# EasyEDA schematic Sensor.json
TITLE: Sensors for RasPi; REV: 1.0; Date: 2024-08-23; Sheet: 1/1; Company: Your Company
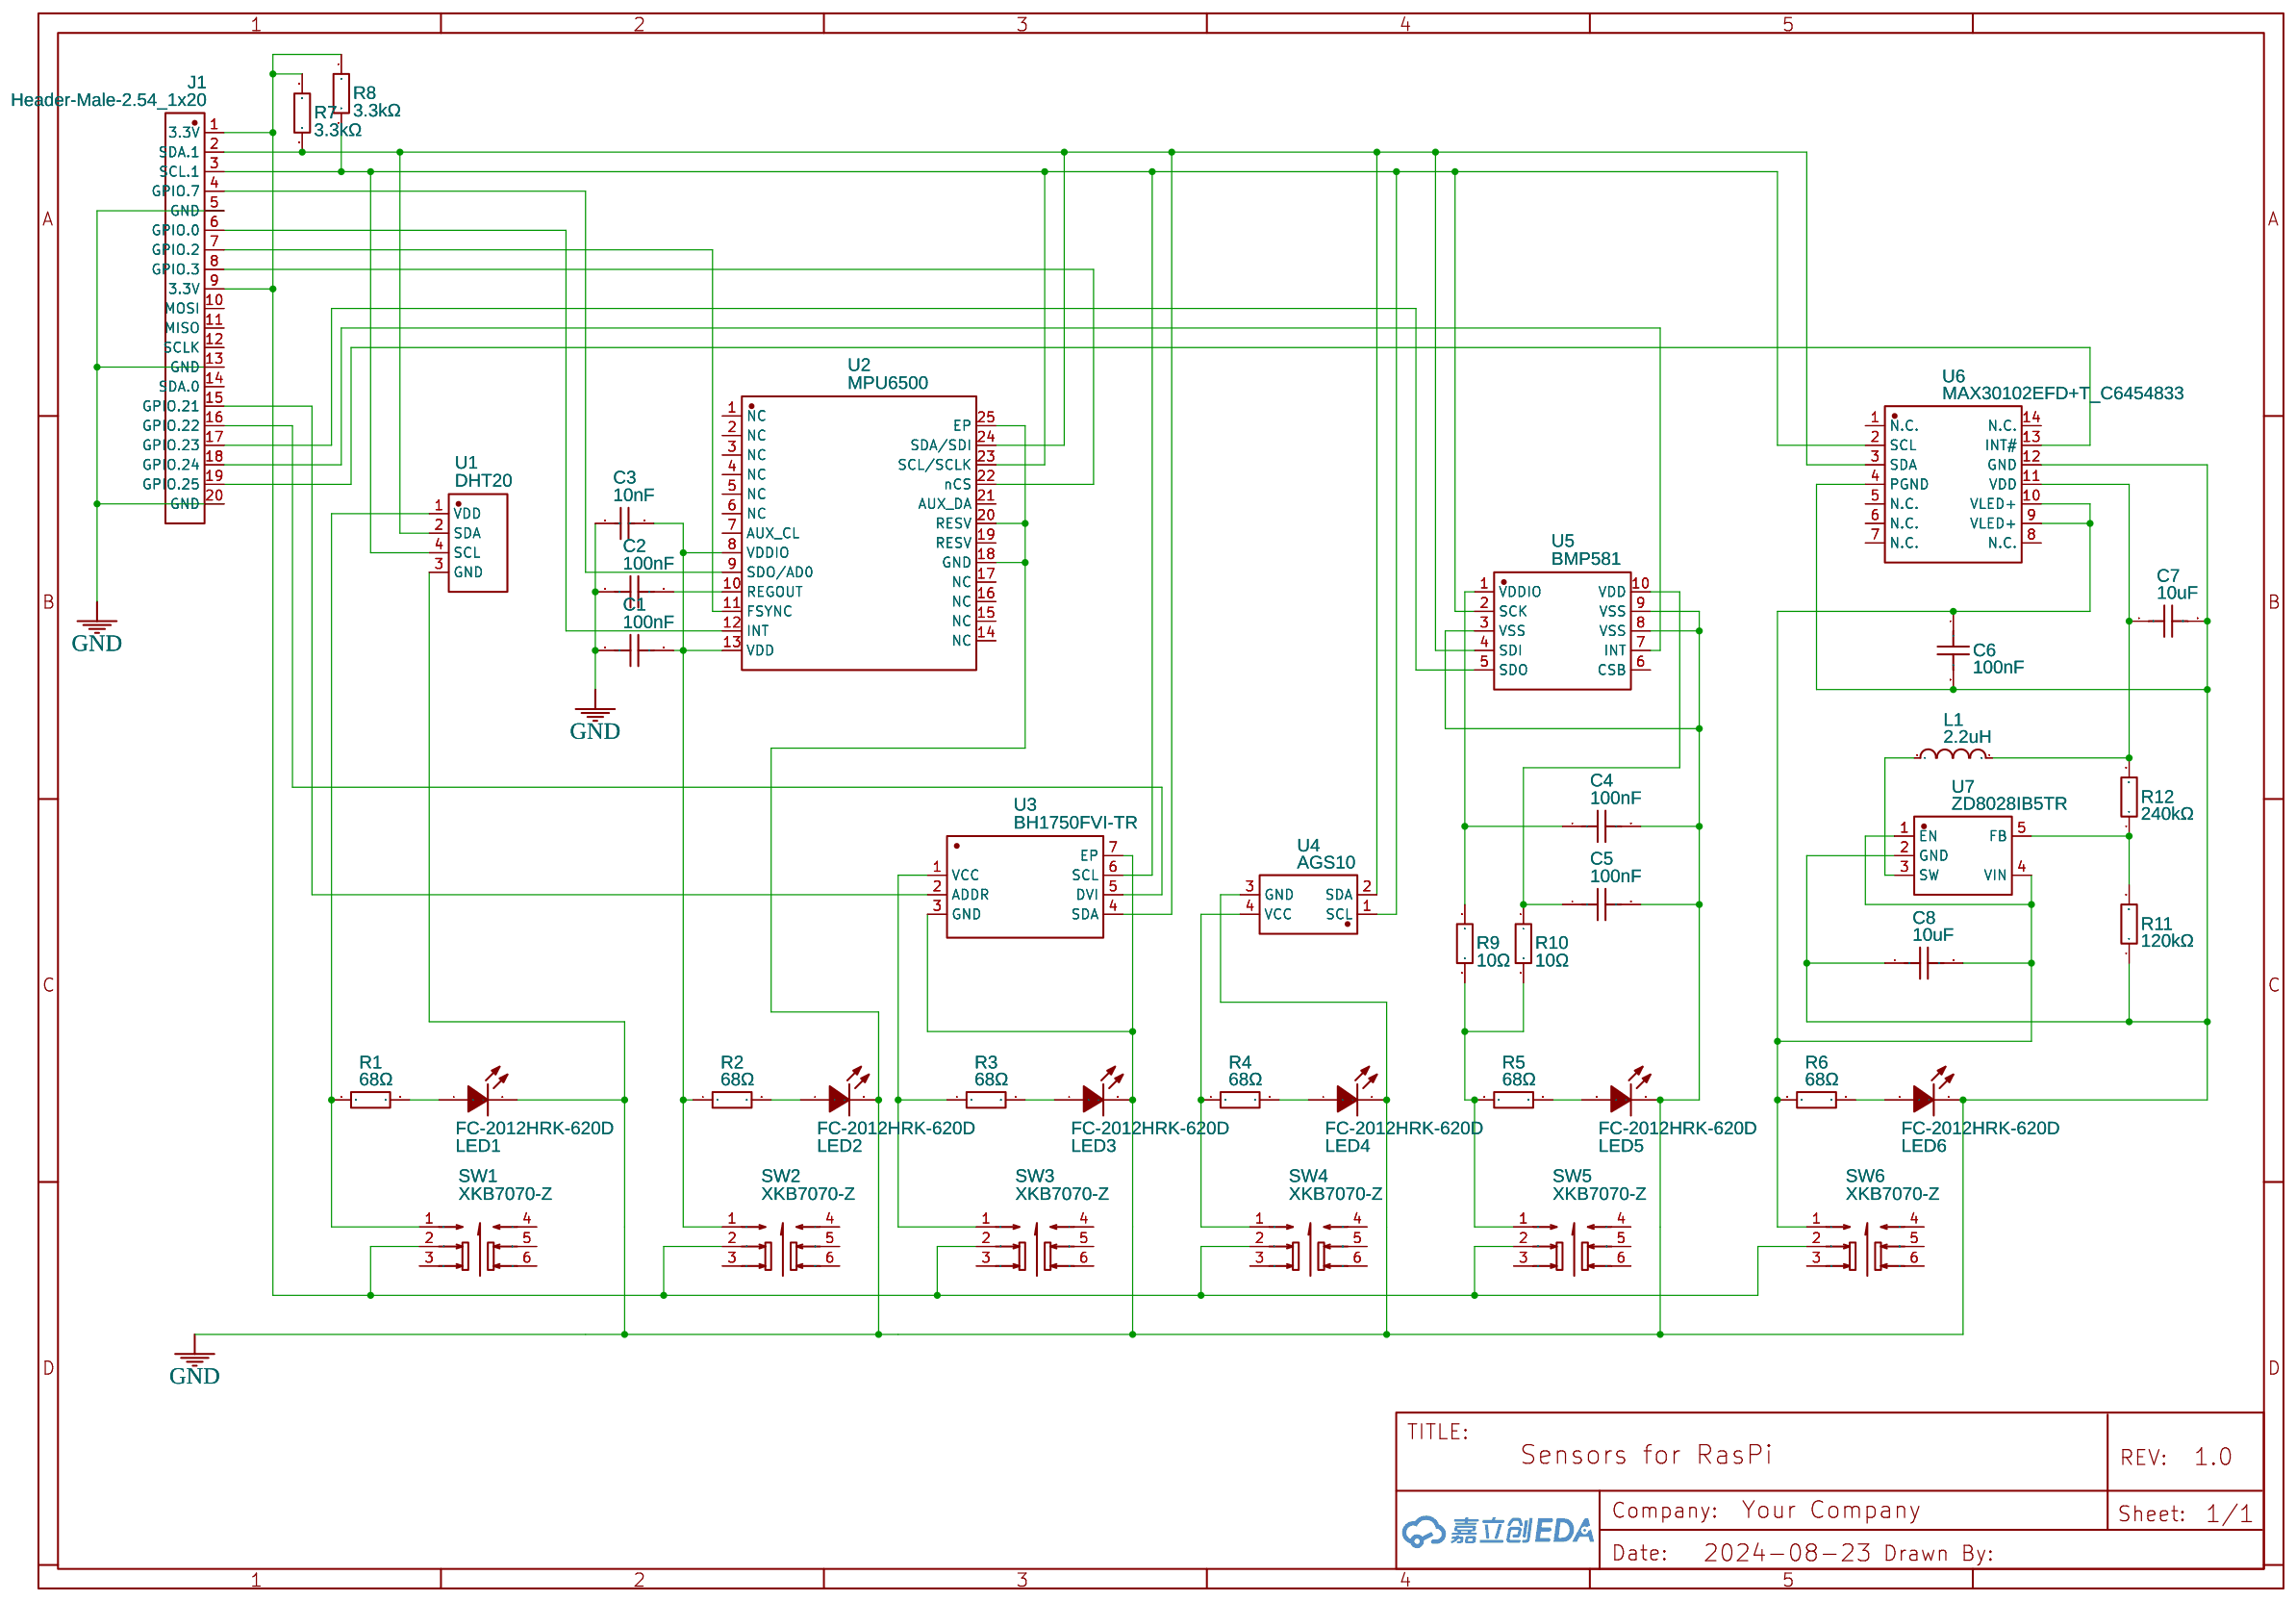
[diagram p0: schematic sheet]

## Parts
C1  100nF  [C0603]
C2  100nF  [C0603]
C3  10nF  [C0603]
C4  100nF  [C0603]
C5  100nF  [C0603]
C6  100nF  [C0603]
C7  10uF  [C0805]
C8  10uF  [C0805]
J1  Header-Male-2.54_1x20  [HDR-TH_20P-P2.54-V-M-1]
L1  2.2uH  [L0805]
LED1  FC-2012HRK-620D  [LED0805-R-RD]
LED2  FC-2012HRK-620D  [LED0805-R-RD]
LED3  FC-2012HRK-620D  [LED0805-R-RD]
LED4  FC-2012HRK-620D  [LED0805-R-RD]
LED5  FC-2012HRK-620D  [LED0805-R-RD]
LED6  FC-2012HRK-620D  [LED0805-R-RD]
R1  68Ω  [R0805]
R2  68Ω  [R0805]
R3  68Ω  [R0805]
R4  68Ω  [R0805]
R5  68Ω  [R0805]
R6  68Ω  [R0805]
R7  3.3kΩ  [R0603]
R8  3.3kΩ  [R0603]
R9  10Ω  [R0603]
R10  10Ω  [R0603]
R11  120kΩ  [R0603]
R12  240kΩ  [R0603]
SW1  XKB7070-Z  [SW-TH_6P-L7.0-W7.0-P2.00]
SW2  XKB7070-Z  [SW-TH_6P-L7.0-W7.0-P2.00]
SW3  XKB7070-Z  [SW-TH_6P-L7.0-W7.0-P2.00]
SW4  XKB7070-Z  [SW-TH_6P-L7.0-W7.0-P2.00]
SW5  XKB7070-Z  [SW-TH_6P-L7.0-W7.0-P2.00]
SW6  XKB7070-Z  [SW-TH_6P-L7.0-W7.0-P2.00]
U1  DHT20  [SENSOR-TH_DHT20]
U2  MPU6500  [QFN-24_L3.0-W3.0-P0.40-BL-EP]
U3  BH1750FVI-TR  [WSOF-6_L2.6-W1.6-P0.50-TL-EP]
U4  AGS10  [SENSOR-SMD_AGS10]
U5  BMP581  [LGA-10_L2.0-W2.0-P0.50-TL_BMP581]
U6  MAX30102EFD+T_C6454833  [OESIP-14_L5.6-W3.3-P0.80-TL]
U7  ZD8028IB5TR  [SOT-23-5_L2.9-W1.6-P0.95-LS2.9-BL]

## Library data of the parts
C1 C2 C4-C6 = CC0603KRX7R9BB104: Supplier: LCSC; Manufacturer: YAGEO(国巨); Supplier Part: C14663; JLCPCB Part Class: Basic Part
C3 = CC0603KRX7R9BB103: Supplier: LCSC; Manufacturer: YAGEO(国巨); Supplier Part: C100042; JLCPCB Part Class: Extended Part
C7 C8 = CL21A106KAYNNNE: Supplier: LCSC; Manufacturer: SAMSUNG(三星); Supplier Part: C15850; JLCPCB Part Class: Basic Part
J1 = Header-Male-2.54_1x20: Supplier: LCSC; Manufacturer: BOOMELE(博穆精密); Manufacturer Part: 2.54-1*20P直针; Supplier Part: C50981; JLCPCB Part Class: Extended Part
L1 = CMI201209U2R2KT: Supplier: LCSC; Manufacturer: FH(风华); Supplier Part: C1043; JLCPCB Part Class: Extended Part
LED1-LED6 = FC-2012HRK-620D: Supplier: LCSC; Manufacturer: 国星光电; Manufacturer Part: NCD0805R1; Supplier Part: C84256; JLCPCB Part Class: Basic Part; link: https://so.szlcsc.com/global.html?k=C84256&ref=editor
R1-R6 = 0805W8F680JT5E: Supplier: LCSC; Manufacturer: UNI-ROYAL(厚声); Supplier Part: C17802; JLCPCB Part Class: Extended Part
R7 R8 = 0603WAF3301T5E: Supplier: LCSC; Manufacturer: UNI-ROYAL(厚声); Supplier Part: C22978; JLCPCB Part Class: Basic Part
R9 R10 = 0603WAF100JT5E: Supplier: LCSC; Manufacturer: UNI-ROYAL(厚声); Supplier Part: C22859; JLCPCB Part Class: Basic Part
R11 = 0603WAF1203T5E: Supplier: LCSC; Manufacturer: UNI-ROYAL(厚声); Supplier Part: C25808; JLCPCB Part Class: Basic Part
R12 = 0603WAF2403T5E: Supplier: LCSC; Manufacturer: UNI-ROYAL(厚声); Supplier Part: C4197; JLCPCB Part Class: Extended Part
SW1-SW6 = XKB7070-Z: Contributor: LCSC; Supplier: LCSC; Supplier Part: C318863; Manufacturer: XKB Connectivity(中国星坤); JLCPCB Part Class: Extended Part
U1 = DHT20: Contributor: lcsc; Supplier: LCSC; Supplier Part: C3012627; Manufacturer: 广州奥松; JLCPCB Part Class: Extended Part
U2 = MPU6500: Supplier: LCSC; Manufacturer: TDK InvenSense(应美盛); Manufacturer Part: MPU-6500; Supplier Part: C50278; JLCPCB Part Class: Extended Part
U3 = BH1750FVI-TR: Supplier: LCSC; Manufacturer: ROHM(罗姆); Supplier Part: C78960; JLCPCB Part Class: Extended Part
U4 = AGS10: Contributor: lcsc; Supplier: LCSC; Supplier Part: C3012632; Manufacturer: 广州奥松; JLCPCB Part Class: Extended Part
U5 = BMP581: Supplier: LCSC; Supplier Part: C5362283; Manufacturer: Bosch(博世); JLCPCB Part Class: Extended Part; Contributor: lcsc
U6 = MAX30102EFD+T_C6454833: Supplier: LCSC; Supplier Part: C6454833; Manufacturer: ADI(亚德诺)/MAXIM(美信); Manufacturer Part: MAX30102EFD+T; JLCPCB Part Class: Extended Part
U7 = ZD8028IB5TR: Contributor: lcsc; Supplier: LCSC; Supplier Part: C2928932; Manufacturer: Zetta(澜智); JLCPCB Part Class: Extended Part

## Nets
GND: C1.1 C2.1 C3.1 C4.2 C5.2 C6.2 C7.2 C8.1 J1.5(GND) J1.13(GND) J1.20(GND) LED1.2(-) LED2.2(-) LED3.2(-) LED4.2(-) LED5.2(-) LED6.2(-) R11.1 U1.3(GND) U2.18(GND) U2.20(RESV) U2.25(EP) U3.3(GND) U3.7(EP) U4.3(GND) U5.3(VSS) U5.8(VSS) U5.9(VSS) U6.4(PGND) U6.12(GND) U7.2(GND)
Net-(C1-2): C1.2 C3.2 R2.1 SW2.1 U2.8(VDDIO) U2.13(VDD)
Net-(C2-2): C2.2 U2.10(REGOUT)
Net-(C4-1): C4.1 R9.2 U5.1(VDDIO)
Net-(C5-1): C5.1 R10.1 U5.10(VDD)
Net-(C6-1): C6.1 C8.2 R6.1 SW6.1 U6.9(VLED+) U6.10(VLED+) U7.1(EN) U7.4(VIN)
Net-(C7-1): C7.1 L1.2 R12.2 U6.11(VDD)
Net-(J1-1): J1.1(3.3V) J1.9(3.3V) R7.2 R8.1 SW1.2 SW2.2 SW3.2 SW4.2 SW5.2 SW6.2
Net-(J1-2): J1.2(SDA.1) R7.1 U1.2(SDA) U2.24(SDA/SDI) U3.4(SDA) U4.2(SDA) U5.4(SDI) U6.3(SDA)
Net-(J1-3): J1.3(SCL.1) R8.2 U1.4(SCL) U2.23(SCL/SCLK) U3.6(SCL) U4.1(SCL) U5.2(SCK) U6.2(SCL)
Net-(J1-4): J1.4(GPIO.7) U2.9(SDO/AD0)
Net-(J1-6): J1.6(GPIO.0) U2.12(INT)
Net-(J1-7): J1.7(GPIO.2) U2.11(FSYNC)
Net-(J1-8): J1.8(GPIO.3) U2.22(nCS)
Net-(J1-15): J1.15(GPIO.21) U3.2(ADDR)
Net-(J1-16): J1.16(GPIO.22) U3.5(DVI)
Net-(J1-17): J1.17(GPIO.23) U5.5(SDO)
Net-(J1-18): J1.18(GPIO.24) U5.7(INT)
Net-(J1-19): J1.19(GPIO.25) U6.13(INT#)
Net-(L1-1): L1.1 U7.3(SW)
Net-(LED1-1): LED1.1(+) R1.2
Net-(LED2-1): LED2.1(+) R2.2
Net-(LED3-1): LED3.1(+) R3.2
Net-(LED4-1): LED4.1(+) R4.2
Net-(LED5-1): LED5.1(+) R5.2
Net-(LED6-1): LED6.1(+) R6.2
Net-(R1-1): R1.1 SW1.1 U1.1(VDD)
Net-(R3-1): R3.1 SW3.1 U3.1(VCC)
Net-(R4-1): R4.1 SW4.1 U4.4(VCC)
Net-(R5-1): R5.1 R9.1 R10.2 SW5.1
Net-(R11-2): R11.2 R12.1 U7.5(FB)

Not connected (* = marked no-connect by the designer): J1 10(MOSI) 11(MISO) 12(SCLK) 14(SDA.0); SW1 3 4 5 6; SW2 3 4 5 6; SW3 3 4 5 6; SW4 3 4 5 6; SW5 3 4 5 6; SW6 3 4 5 6; U2 1(NC) 2(NC) 3(NC) 4(NC) 5(NC) 6(NC) 7(AUX_CL) 14(NC) 15(NC) 16(NC) 17(NC) 19(RESV) 21(AUX_DA); U5 6(CSB); U6 1(N.C.) 5(N.C.) 6(N.C.) 7(N.C.) 8(N.C.) 14(N.C.)
